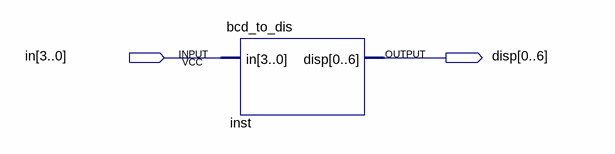
[diagram p0: schematic sheet]
// Quartus schematic blk_bcd.bdf as structural Verilog: 1 symbols, 2 pins
module blk_bcd (
  input  [3:0] in,
  output [0:6] disp
);

  bcd_to_dis inst (.in(in), .disp(disp));
endmodule
